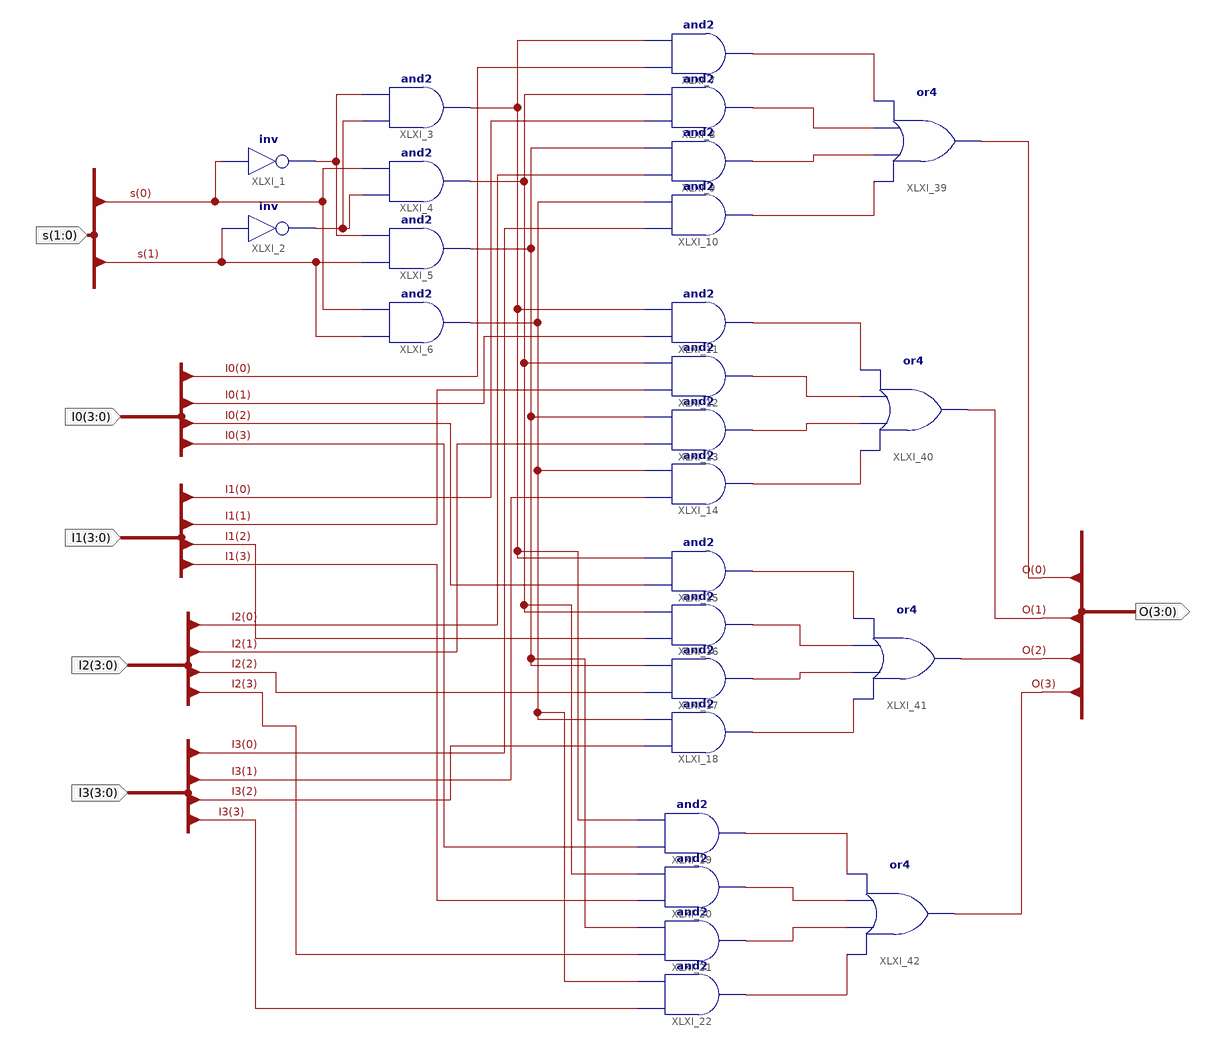
[diagram p0: schematic sheet 1]
// Xilinx ISE schematic Mux4to1b4_sch.sch (kintex7) as structural Verilog: 26 symbols, 6 ports
module Mux4to1b4_sch (
  input  [1:0] s,
  input  [3:0] I1,
  input  [3:0] I2,
  input  [3:0] I3,
  input  [3:0] I0,
  output [3:0] O
);

  wire XLXN_5, XLXN_6, XLXN_10, XLXN_11, XLXN_13, XLXN_14, XLXN_66, XLXN_67, XLXN_68, XLXN_69, XLXN_70,
       XLXN_71, XLXN_72, XLXN_73, XLXN_74, XLXN_75, XLXN_76, XLXN_77, XLXN_78, XLXN_79, XLXN_80, XLXN_81;

  not XLXI_1 (XLXN_5, s[0]);
  not XLXI_2 (XLXN_6, s[1]);
  and XLXI_3 (XLXN_10, XLXN_6, XLXN_5);
  and XLXI_4 (XLXN_11, XLXN_6, s[0]);
  and XLXI_5 (XLXN_13, s[1], XLXN_5);
  and XLXI_6 (XLXN_14, s[1], s[0]);
  and XLXI_7 (XLXN_66, I0[0], XLXN_10);
  and XLXI_8 (XLXN_67, I1[0], XLXN_11);
  and XLXI_9 (XLXN_68, I2[0], XLXN_13);
  and XLXI_10 (XLXN_69, I3[0], XLXN_14);
  or XLXI_39 (O[0], XLXN_69, XLXN_68, XLXN_67, XLXN_66);
  or XLXI_42 (O[3], XLXN_81, XLXN_80, XLXN_79, XLXN_78);
  and XLXI_22 (XLXN_81, I3[3], XLXN_14);
  and XLXI_21 (XLXN_80, I2[3], XLXN_13);
  and XLXI_20 (XLXN_79, I1[3], XLXN_11);
  and XLXI_19 (XLXN_78, I0[3], XLXN_10);
  or XLXI_40 (O[1], XLXN_73, XLXN_72, XLXN_71, XLXN_70);
  and XLXI_14 (XLXN_73, I3[1], XLXN_14);
  and XLXI_13 (XLXN_72, I2[1], XLXN_13);
  and XLXI_12 (XLXN_71, I1[1], XLXN_11);
  and XLXI_11 (XLXN_70, I0[1], XLXN_10);
  or XLXI_41 (O[2], XLXN_77, XLXN_76, XLXN_75, XLXN_74);
  and XLXI_18 (XLXN_77, I3[2], XLXN_14);
  and XLXI_17 (XLXN_76, I2[2], XLXN_13);
  and XLXI_16 (XLXN_75, I1[2], XLXN_11);
  and XLXI_15 (XLXN_74, I0[2], XLXN_10);
endmodule
